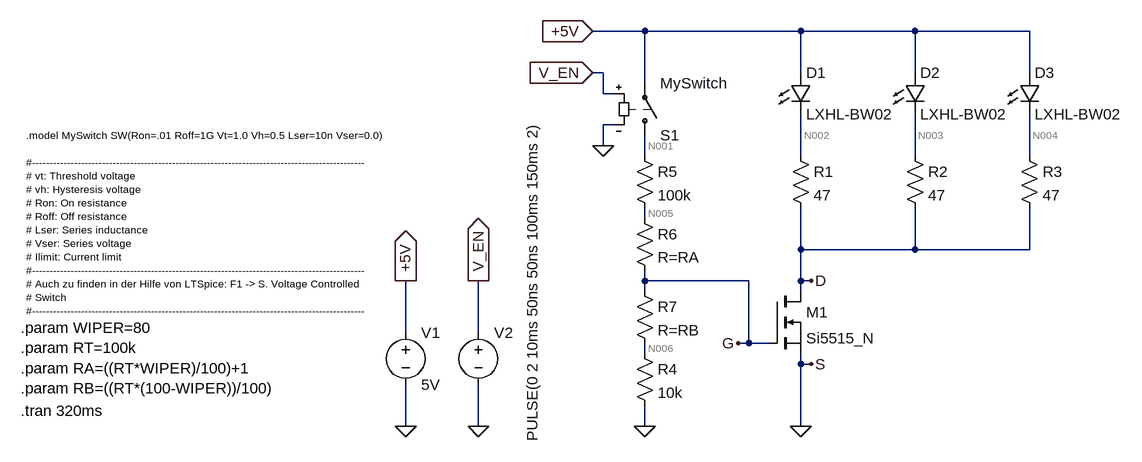
[diagram p0: schematic Projekt_12_MOSFET_als_Schalter.asc]
Projekt_12_MOSFET_als_Schalter.asc, the LTspice schematic file:
Version 4
SHEET 1 1988 680
WIRE 592 -400 512 -400
WIRE 832 -400 592 -400
WIRE 1008 -400 832 -400
WIRE 1184 -400 1008 -400
WIRE 528 -336 512 -336
WIRE 832 -336 832 -400
WIRE 1008 -336 1008 -400
WIRE 1184 -336 1184 -400
WIRE 592 -320 592 -400
WIRE 528 -304 528 -336
WIRE 544 -304 528 -304
WIRE 544 -256 528 -256
WIRE 528 -224 528 -256
WIRE 592 -208 592 -240
WIRE 832 -208 832 -272
WIRE 1008 -208 1008 -272
WIRE 1184 -208 1184 -272
WIRE 592 -112 592 -128
WIRE 832 -64 832 -128
WIRE 1008 -64 1008 -128
WIRE 1008 -64 832 -64
WIRE 1184 -64 1184 -128
WIRE 1184 -64 1008 -64
WIRE 592 -16 592 -32
WIRE 752 -16 592 -16
WIRE 832 -16 832 -64
WIRE 848 -16 832 -16
WIRE 592 0 592 -16
WIRE 832 0 832 -16
WIRE 224 64 224 -16
WIRE 336 64 336 -16
WIRE 752 80 752 -16
WIRE 752 80 736 80
WIRE 784 80 752 80
WIRE 592 96 592 80
WIRE 832 112 832 96
WIRE 848 112 832 112
WIRE 224 208 224 144
WIRE 336 208 336 144
WIRE 592 208 592 176
WIRE 832 208 832 112
FLAG 224 -16 +5V
IOPIN 224 -16 Out
FLAG 336 -16 V_EN
IOPIN 336 -16 Out
FLAG 224 208 0
FLAG 336 208 0
FLAG 512 -336 V_EN
IOPIN 512 -336 In
FLAG 528 -224 0
FLAG 832 208 0
FLAG 512 -400 +5V
IOPIN 512 -400 In
FLAG 592 208 0
FLAG 848 -16 D
FLAG 848 112 S
FLAG 736 80 G
SYMBOL nmos 784 0 R0
SYMATTR InstName M1
SYMATTR Value Si5515_N
SYMBOL LED 816 -336 R0
SYMATTR InstName D1
SYMATTR Value LXHL-BW02
SYMATTR Description Diode
SYMATTR Type diode
SYMBOL LED 992 -336 R0
SYMATTR InstName D2
SYMATTR Value LXHL-BW02
SYMATTR Description Diode
SYMATTR Type diode
SYMBOL LED 1168 -336 R0
SYMATTR InstName D3
SYMATTR Value LXHL-BW02
SYMATTR Description Diode
SYMATTR Type diode
SYMBOL res 816 -224 R0
SYMATTR InstName R1
SYMATTR Value 47
SYMBOL res 992 -224 R0
SYMATTR InstName R2
SYMATTR Value 47
SYMBOL res 1168 -224 R0
SYMATTR InstName R3
SYMATTR Value 47
SYMBOL voltage 224 48 R0
WINDOW 123 0 0 Left 2
WINDOW 39 0 0 Left 2
SYMATTR InstName V1
SYMATTR Value 5V
SYMBOL voltage 336 48 R0
WINDOW 3 83 183 VLeft 2
WINDOW 123 0 0 Left 2
WINDOW 39 0 0 Left 2
SYMATTR Value PULSE(0 2 10ms 50ns 50ns 100ms 150ms 2)
SYMATTR InstName V2
SYMBOL sw 592 -224 M180
SYMATTR InstName S1
SYMATTR Value MySwitch
SYMBOL res 576 80 R0
SYMATTR InstName R4
SYMATTR Value 10k
SYMBOL res 576 -224 R0
SYMATTR InstName R5
SYMATTR Value 100k
SYMBOL res 576 -128 R0
SYMATTR InstName R6
SYMATTR Value R=RA
SYMBOL res 576 -16 R0
SYMATTR InstName R7
SYMATTR Value R=RB
TEXT -360 -240 Left 1 !.model MySwitch SW(Ron=.01 Roff=1G Vt=1.0 Vh=0.5 Lser=10n Vser=0.0)\n \n#-----------------------------------------------------------------------------------------------\n# vt: Threshold voltage\n# vh: Hysteresis voltage\n# Ron: On resistance\n# Roff: Off resistance\n# Lser: Series inductance\n# Vser: Series voltage\n# Ilimit: Current limit\n#-----------------------------------------------------------------------------------------------\n# Auch zu finden in der Hilfe von LTSpice: F1 -> S. Voltage Controlled\n# Switch\n#-----------------------------------------------------------------------------------------------
TEXT -368 184 Left 2 !.tran 320ms
TEXT -368 56 Left 2 !.param WIPER=80\n.param RT=100k\n.param RA=((RT*WIPER)/100)+1\n.param RB=((RT*(100-WIPER))/100)

The netlist it stands for:
* Projekt_12_MOSFET_als_Schalter.asc
M1 D G 0 0 Si5515_N
D1 +5V N002 LXHL-BW02
D2 +5V N003 LXHL-BW02
D3 +5V N004 LXHL-BW02
R1 N002 D 47
R2 N003 D 47
R3 N004 D 47
V1 +5V 0 5V
V2 V_EN 0 PULSE(0 2 10ms 50ns 50ns 100ms 150ms 2)
S1 N001 +5V V_EN 0 MySwitch
R4 N006 0 10k
R5 N001 N005 100k
R6 N005 G R=RA
R7 G N006 R=RB
.model D D
.lib standard.dio
.model NMOS NMOS
.model PMOS PMOS
.lib standard.mos
.model MySwitch SW(Ron=.01 Roff=1G Vt=1.0 Vh=0.5 Lser=10n Vser=0.0)
#-----------------------------------------------------------------------------------------------
# vt: Threshold voltage
# vh: Hysteresis voltage
# Ron: On resistance
# Roff: Off resistance
# Lser: Series inductance
# Vser: Series voltage
# Ilimit: Current limit
#-----------------------------------------------------------------------------------------------
# Auch zu finden in der Hilfe von LTSpice: F1 -> S. Voltage Controlled
# Switch
#-----------------------------------------------------------------------------------------------
.tran 320ms
.param WIPER=80
.param RT=100k
.param RA=((RT*WIPER)/100)+1
.param RB=((RT*(100-WIPER))/100)
.backanno
.end

* Results of the author's LTspice run, read from the files saved beside the schematic
* Operating Point, zero values left out:
*   V(d) = 3.158 V
*   V(g) = 150.1 µV
*   V(+5v) = 5 V
*   V(n002) = 3.158 V
*   V(n003) = 3.158 V
*   V(n004) = 3.158 V
*   V(n001) = 1.051 mV
*   V(n006) = 50.04 µV
*   V(n005) = 550.4 µV
*   I(R7) = 5.004 nA
*   I(R6) = 5.004 nA
*   Id(M1) = 106.1 nA
*   Is(M1) = -106.1 nA
*   I(D3) = 35.38 nA
*   I(D2) = 35.38 nA
*   I(D1) = 35.38 nA
*   I(R5) = 5.004 nA
*   I(R4) = 5.004 nA
*   I(R3) = 35.38 nA
*   I(R2) = 35.38 nA
*   I(R1) = 35.38 nA
*   I(S1) = 5.004 nA
*   I(V1) = -111.2 nA
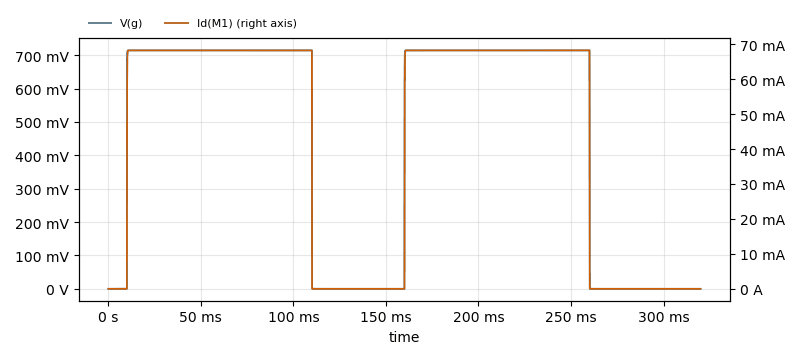
[diagram p1: Transient Analysis of Projekt_12_MOSFET_als_Schalter.asc, plotted from the saved traces]
* Transient Analysis, 1 run:
*   V(g): min 149.8 µV, max 714.3 mV, average 446.5 mV, rms 564.6 mV, last 150.1 µV
*   Id(M1): min -4.679 µA, max 68.25 mA, average 42.61 mA, rms 53.91 mA, last 106.1 nA